# Altium project mdriver_control.PrjPcb
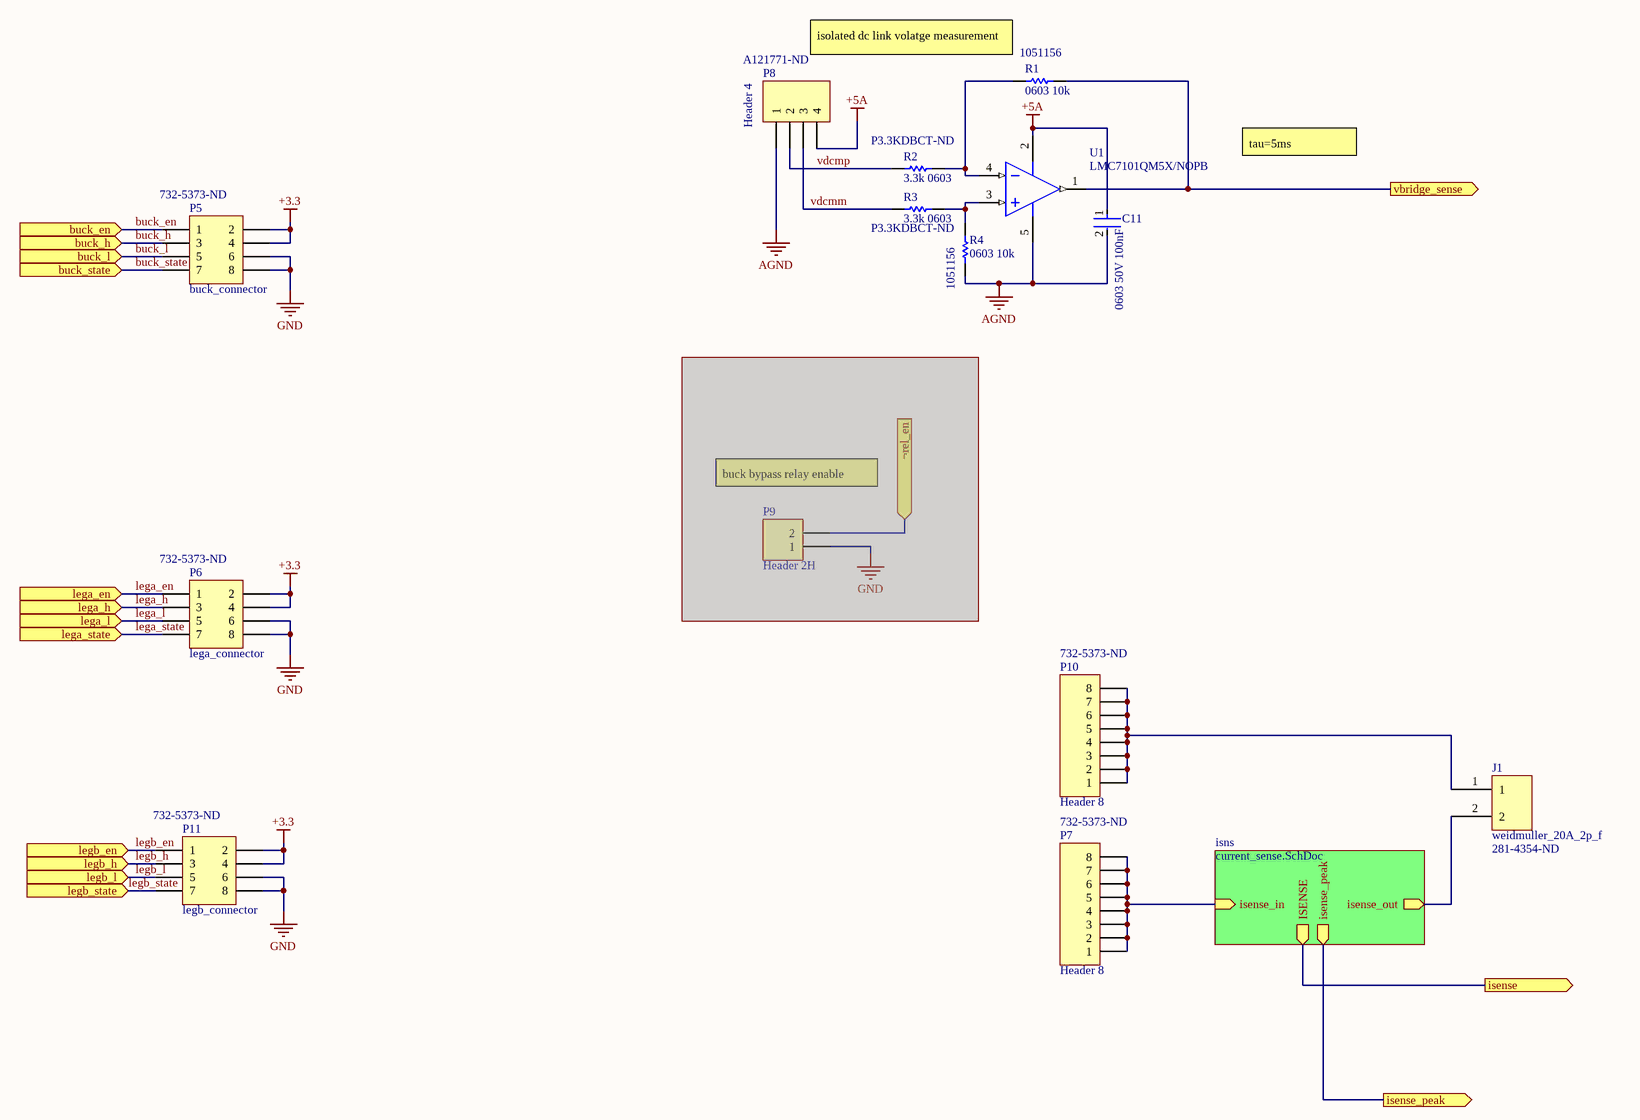
[diagram p0: channel_ctrl.SchDoc]
2 sheets, 33 parts. Net scope: hierarchical (ports join the sheet entries above them; power ports are global).
Board file: mdriver_control.PcbDoc
Sheets:
  channel_ctrl.SchDoc
  slave_interface.SchDoc

## Sheet channel_ctrl.SchDoc
size A3; SheetNumber: 2; SheetTotal: 3

### Parts
C11  0603 50V 100nF  [FP-CGA3E-0_3-0_1-IPC_A]
J1  weidmuller_20A_2p_f  Supplier Part Number 1: 281-4354-ND  [weidmuller_19A_2p_m]
P5  buck_connector  Supplier Part Number 1: 732-5373-ND  [header_4_2_f]
P6  lega_connector  Supplier Part Number 1: 732-5373-ND  [header_4_2_f]
P7  Header 8  Supplier Part Number 1: 732-5373-ND  [header_4_2_f]
P8  Header 4  Supplier Part Number 1: A121771-ND  [header_2_2_f]
P9  Header 2H  [HEADER_1_2_f]  (masked out: inside a compile mask, not in the netlist)
P10  Header 8  Supplier Part Number 1: 732-5373-ND  [header_4_2_f]
P11  legb_connector  Supplier Part Number 1: 732-5373-ND  [header_4_2_f]
R1  0603 10k  Supplier Part Number 1: 1051156  [RES 0805_2012]
R2  3.3k 0603  Supplier Part Number 1: P3.3KDBCT-ND  [RES 0603_1608]
R3  3.3k 0603  Supplier Part Number 1: P3.3KDBCT-ND  [RES 0603_1608]
R4  0603 10k  Supplier Part Number 1: 1051156  [RES 0805_2012]
U1  LMC7101QM5X/NOPB  [DBV0005A_M]

### Sub-sheets
isns = current_sense.SchDoc (file not in this document): isense_in (in), isense_out (out), ISENSE (out), isense_peak (out)

### Ports
buck_en (in), buck_h (in), buck_l (in), buck_state (in), isense (out), isense_peak (out), lega_en (in), lega_h (in), lega_l (in), lega_state (in), legb_en (in), legb_h (in), legb_l (in), legb_state (in), vbridge_sense (out), ¬rel_en (in)

### Nets
+3.3: P5.2 P5.4 P6.2 P6.4 P11.2 P11.4
+5A: C11.1 P8.4 U1.2(V+)
AGND: C11.2 P8.1 R4.1 U1.5(V-)
GND: P5.6 P5.8 P6.6 P6.8 P11.6 P11.8
buck_en: P5.1 ; port buck_en
buck_h: P5.3 ; port buck_h
buck_l: P5.5 ; port buck_l
buck_state: P5.7 ; port buck_state
lega_en: P6.1 ; port lega_en
lega_h: P6.3 ; port lega_h
lega_l: P6.5 ; port lega_l
lega_state: P6.7 ; port lega_state
legb_en: P11.1 ; port legb_en
legb_h: P11.3 ; port legb_h
legb_l: P11.5 ; port legb_l
legb_state: P11.7 ; port legb_state
vdcmm: P8.3 R3.1
vdcmp: P8.2 R2.1
NetJ1_1: J1.1 P10.1 P10.2 P10.3 P10.4 P10.5 P10.6 P10.7 P10.8
NetJ1_2: J1.2 ; sheet isns/isense_out
NetP7_1: P7.1 P7.2 P7.3 P7.4 P7.5 P7.6 P7.7 P7.8 ; sheet isns/isense_in
NetR1_1: R1.1 R2.2 U1.4(IN-)
NetR1_2: R1.2 U1.1(OUT) ; port vbridge_sense
NetR3_2: R3.2 R4.2 U1.3(IN+)
(unnamed): port isense, sheet isns/ISENSE
(unnamed): port isense_peak, sheet isns/isense_peak

### Notes on the sheet
- (near R1) isolated dc link volatge measurement
- tau=5ms
- (near P9) buck bypass relay enable
- 1
- 2
- 3
- 4
- 5
- 6
- 7
- 8
- A
- B
- C
- D
- Project:
- Date:
- Drawing number:
- Rev:
- Format:
- A3
- Drawn by:
- Laboratory:
- Page
- Sheet:
- of
- File:

### Library data of the parts
C11 = CMP-2000-07546-2: Cap Ceramic 100nF 50V X7R 10% Pad SMD 0603 +125°C Automotive T/R / CGA3E2X7R1H104K080AA; Weight: 7.1E-05oz; Composition: Ceramic; Max Operating Temperature: 125°C; Termination: SMD/SMT; Dielectric: X7R; Length: 1.6mm; Package Quantity: 1; REACH SVHC: No SVHC; Lead Free: Lead Free; Case Code (Metric): 1608; Min Operating Temperature: -55°C; Packaging: Tape and Reel; Tolerance: 10%; Voltage Rating: 50V; Case Code (Imperial): 0603; Capacitance: 100nF; Case/Package: 0603; Voltage Rating (DC): 50V; Depth: 0.8mm; Radiation Hardening: No; Ratings: AEC-Q200; Mount: Surface Mount; Voltage: 50V; Thickness: 0.035inch; Width: 0.8mm; Height: 0.8mm
J1 = weidmuller_20A_2p_f: Connector Block 19A Male Receptor; Supplier 1: Digi-Key
P5 P6 P11 = Header 4X2: Header, 4-Pin, Dual row; LatestRevisionDate: 17-Jul-2002; LatestRevisionNote: Re-released for DXP Platform.; Publisher: Altium Limited; System: Connector; Supplier 1: Digi-Key
P7 P10 = Header 8: Header, 8-Pin; LatestRevisionDate: 17-Jul-2002; LatestRevisionNote: Re-released for DXP Platform.; Publisher: Altium Limited; Supplier 1: Digi-Key
P8 = Header 4: Header, 4-Pin; LatestRevisionDate: 17-Jul-2002; LatestRevisionNote: Re-released for DXP Platform.; Publisher: Altium Limited; Supplier 1: Digi-Key
P9 = Header 2H: Header, 2-Pin, Right Angle; LatestRevisionDate: 17-Jul-2002; LatestRevisionNote: Re-released for DXP Platform.; Publisher: Altium Limited
R1-R4 = Res1: Resistor; Value: 1K; Published: 8-Jun-2000; LatestRevisionDate: 17-Jul-2002; LatestRevisionNote: Re-released for DXP Platform.; PackageReference: AXIAL-0.3; Publisher: Altium Limited; PackageDescription: Axial Device, Thru-Hole; 2 Leads; 0.3 in Pin Spacing
  R1 R4: Supplier 1: RSComponents
  R2 R3: Supplier 1: Digi-Key
U1 = CMP-0055-01329-3: Tiny Low power Operational Amplifier with Rail-to-Rail Input and Output, 5-pin SOT-23, Pb-Free; Manufacturer: Texas Instruments; CompType: Amplifiers; PackageTopMarking: AT6A*XTT; PowerWise: N; RoHS: Y; ComponentLink1URL: http://www.ti.com/general/docs/lit/getliterature.tsp?genericPartNumber=LMC7101Q-Q1&fileType=pdf; ComponentLink1Description: Datasheet URL; Package Reference: DBV0005A; PackageDescription: Molded SOT-23, .115 x .063 x .040 in Body, 5 Lead, .0375 in Pitch; PinCount: 5

## Sheet slave_interface.SchDoc
size A4; SheetNumber: 4; SheetTotal: 4
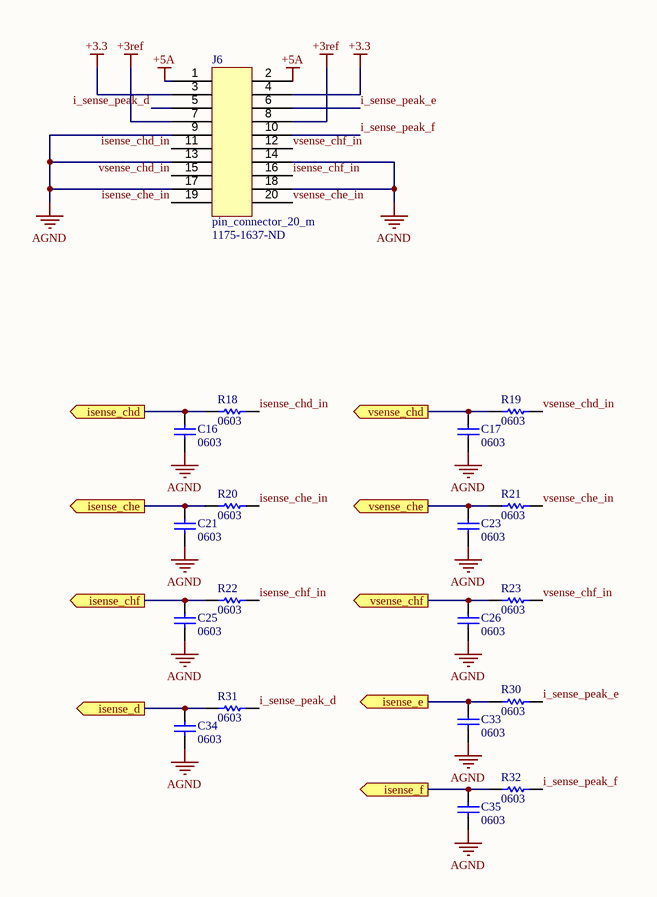
[diagram p1: slave_interface.SchDoc]

### Parts
C16  0603  [CAP 0603_1608]
C17  0603  [CAP 0603_1608]
C21  0603  [CAP 0603_1608]
C23  0603  [CAP 0603_1608]
C25  0603  [CAP 0603_1608]
C26  0603  [CAP 0603_1608]
C33  0603  [CAP 0603_1608]
C34  0603  [CAP 0603_1608]
C35  0603  [CAP 0603_1608]
J6  pin_connector_20_m  Supplier Part Number 1: 1175-1637-ND  [PIN_20_MALE_3220-20-0300-00]
R18  0603  [RES 0603_1608]
R19  0603  [RES 0603_1608]
R20  0603  [RES 0603_1608]
R21  0603  [RES 0603_1608]
R22  0603  [RES 0603_1608]
R23  0603  [RES 0603_1608]
R30  0603  [RES 0603_1608]
R31  0603  [RES 0603_1608]
R32  0603  [RES 0603_1608]

### Ports
isense_chd (out), isense_che (out), isense_chf (out), isense_d (out), isense_e (out), isense_f (out), vsense_chd (out), vsense_che (out), vsense_chf (out)

### Nets
+3.3: J6.3 J6.4
+3ref: J6.7 J6.8
+5A: J6.1 J6.2
AGND: C16.1 C17.1 C21.1 C23.1 C25.1 C26.1 C33.1 C34.1 C35.1 J6.9 J6.13 J6.14 J6.17 J6.18
i_sense_peak_d: J6.5 R31.2
i_sense_peak_e: J6.6 R30.2
i_sense_peak_f: J6.10 R32.2
isense_chd_in: J6.11 R18.2
isense_che_in: J6.19 R20.2
isense_chf_in: J6.16 R22.2
vsense_chd_in: J6.15 R19.2
vsense_che_in: J6.20 R21.2
vsense_chf_in: J6.12 R23.2
NetC16_2: C16.2 R18.1 ; port isense_chd
NetC17_2: C17.2 R19.1 ; port vsense_chd
NetC21_2: C21.2 R20.1 ; port isense_che
NetC23_2: C23.2 R21.1 ; port vsense_che
NetC25_2: C25.2 R22.1 ; port isense_chf
NetC26_2: C26.2 R23.1 ; port vsense_chf
NetC33_2: C33.2 R30.1 ; port isense_e
NetC34_2: C34.2 R31.1 ; port isense_d
NetC35_2: C35.2 R32.1 ; port isense_f

### Notes on the sheet
- 1
- 2
- 3
- 4
- A
- B
- C
- Project:
- D
- Date:
- Drawing number:
- Rev:
- Format:
- A4 Q
- Drawn by:
- Laboratory:
- Page
- Sheet:
- of
- File:

### Library data of the parts
C16 C17 C21 C23 C25 C26 C33-C35 = Cap: Capacitor; Published: 8-Jun-2000; LatestRevisionDate: 17-Jul-2002; LatestRevisionNote: Re-released for DXP Platform.; PackageReference: RAD-0.3; Publisher: Altium Limited; PackageDescription: Radial Cap, Thru-Hole; 2 Leads; 0.3 in Pin Spacing
R18-R23 R30-R32 = Res1: Resistor; Published: 8-Jun-2000; LatestRevisionDate: 17-Jul-2002; LatestRevisionNote: Re-released for DXP Platform.; PackageReference: AXIAL-0.3; Publisher: Altium Limited; PackageDescription: Axial Device, Thru-Hole; 2 Leads; 0.3 in Pin Spacing
J6 = pin_connector_20_m: Supplier 1: Digi-Key

## Nets that join several sheets
+3.3: channel_ctrl (6 pins), slave_interface (J6.3 J6.4)
+5A: channel_ctrl (C11.1 P8.4 U1.2), slave_interface (J6.1 J6.2)
AGND: channel_ctrl (C11.2 P8.1 R4.1 U1.5), slave_interface (14 pins)